# EAGLE design atari-2600-video-mod-v1.0 (EAGLE 7.6.0)
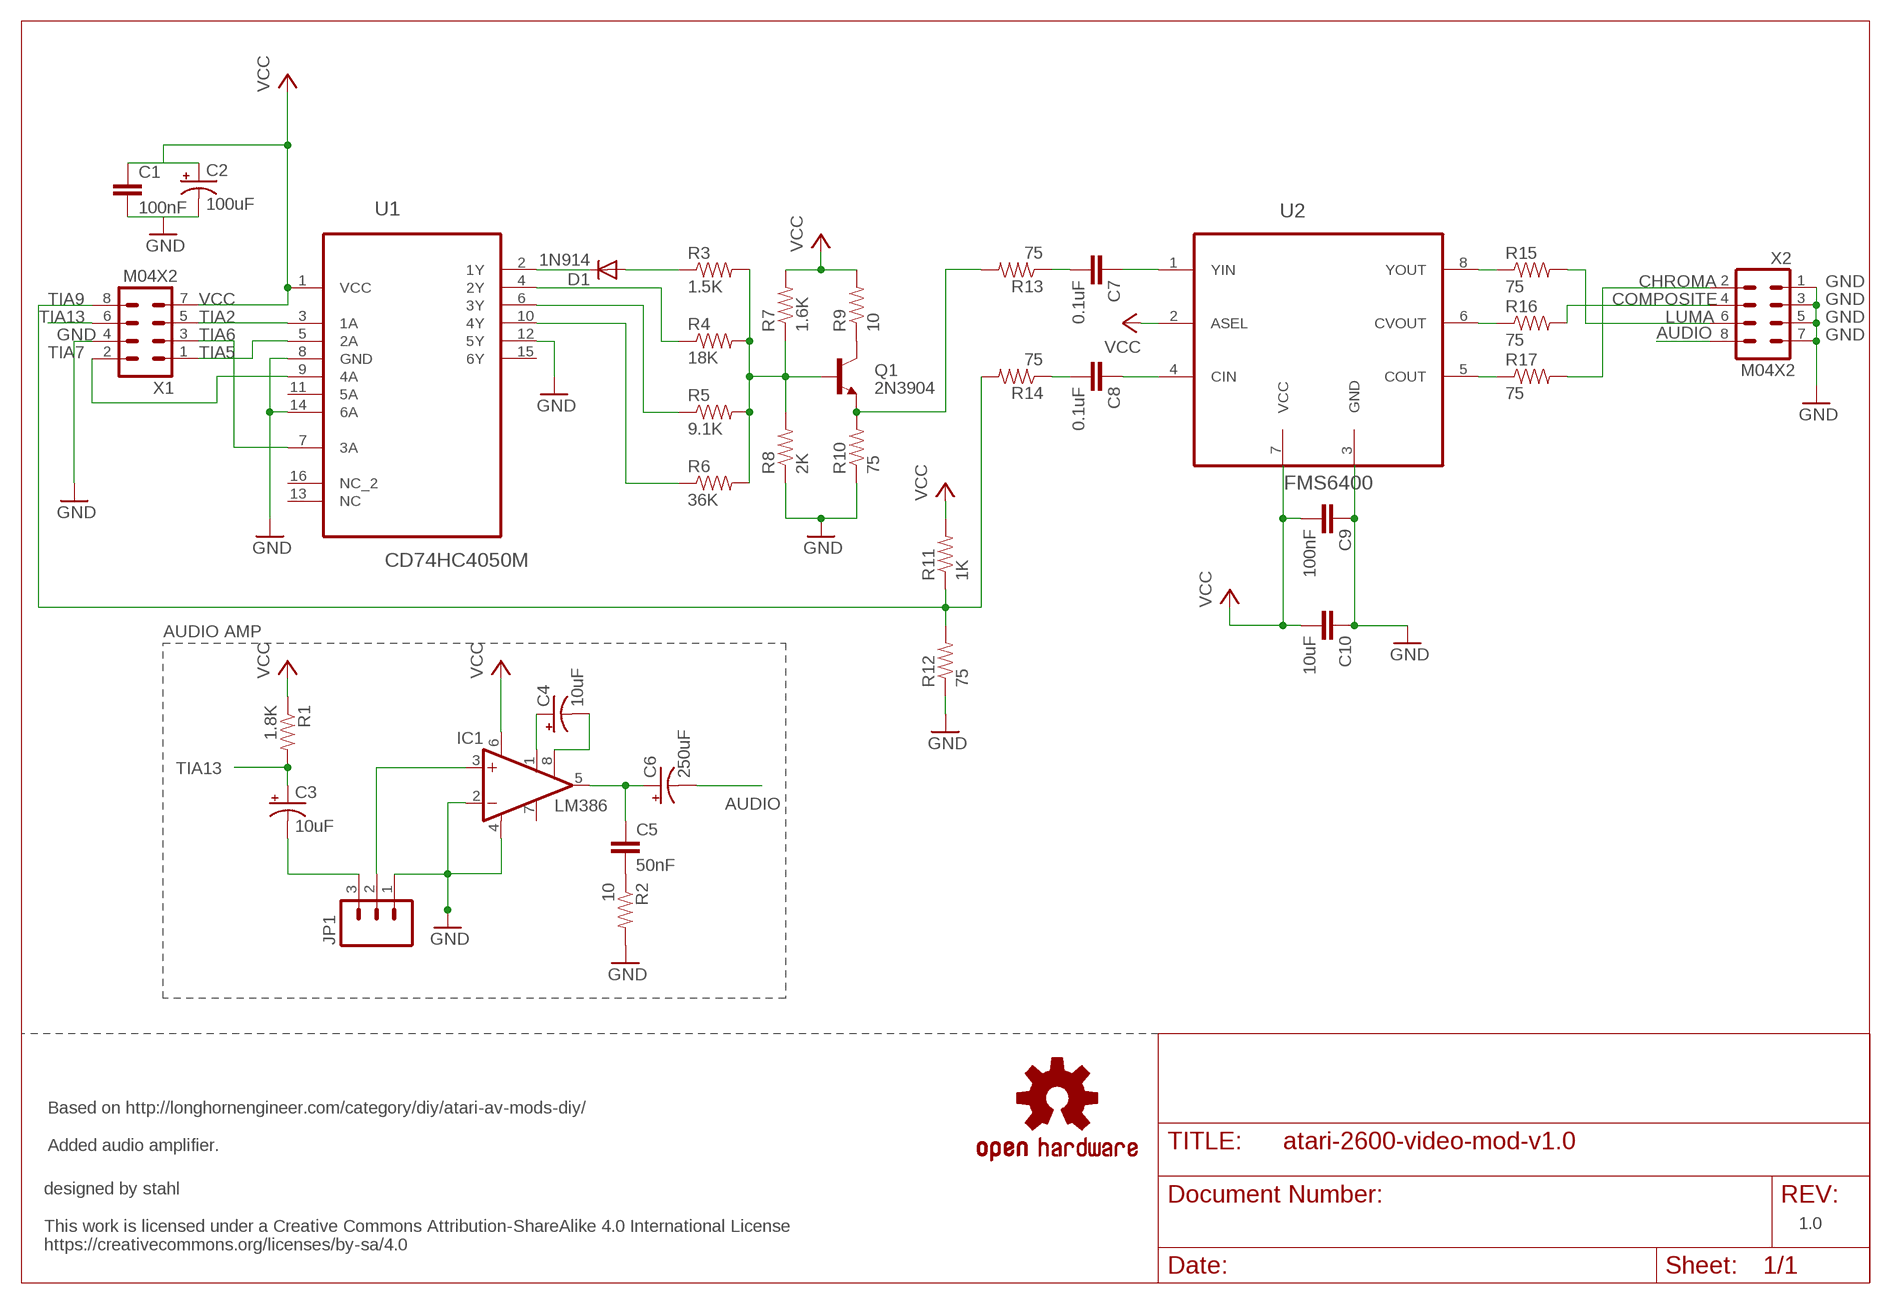
[diagram p0: schematic, sheet 1]

## Parts
C1  100nF  CAP1206  [1206]
C2  100uF  CPOL-USD  [PANASONIC_D]
C3  10uF  CPOL-USB  [PANASONIC_B]
C4  10uF  CPOL-USB  [PANASONIC_B]
C5  50nF  CAP1206  [1206]
C6  250uF  CPOL-USD  [PANASONIC_D]
C7  0.1uF  CAP1206  [1206]
C8  0.1uF  CAP1206  [1206]
C9  100nF  CAP1206  [1206]
C10  10uF  CAP1206  [1206]
D1  1N914  DIODE-SOD80C  [SOD80C]
IC1  LM386  LM386M-1  [SO08]
JP1  M03LONGPADS  [1X03_LONGPADS]
LOGO1  OSHW-LOGOS  [OSHW-LOGO-S]
Q1  2N3904  TRANSISTOR_NPNSOT23  [SOT23]
R1  1.8K  RESISTOR1206  [1206]
R2  10  RESISTOR1206  [1206]
R3  1.5K  RESISTOR1206  [1206]
R4  18K  RESISTOR1206  [1206]
R5  9.1K  RESISTOR1206  [1206]
R6  36K  RESISTOR1206  [1206]
R7  1.6K  RESISTOR1206  [1206]
R8  2K  RESISTOR1206  [1206]
R9  10  RESISTOR1206  [1206]
R10  75  RESISTOR1206  [1206]
R11  1K  RESISTOR1206  [1206]
R12  75  RESISTOR1206  [1206]
R13  75  RESISTOR1206  [1206]
R14  75  RESISTOR1206  [1206]
R15  75  RESISTOR1206  [1206]
R16  75  RESISTOR1206  [1206]
R17  75  RESISTOR1206  [1206]
U1  CD74HC4050M  [SOIC127P600X175-16N]
U2  FMS6400  [SOIC-8]
X1  M04X2  [2X4]
X2  M04X2  [2X4]

## Nets
AUDIO: C6.- X2.8
CHROMA: R17.2 X2.2
COMPOSITE: R16.2 X2.4
GND: C1.2 C2.- C9.1 C10.1 IC1.2(-IN) IC1.4(GND) JP1.1 R2.2 R8.1 R10.1 R12.1 U1.8(GND) U1.12(5Y) U1.14(6A) U2.3(GND) X1.4 X2.1 X2.3 X2.5 X2.7
LUMA: R15.2 X2.6
N$1: C8.1 U2.4(CIN)
N$2: R4.1 U1.4(2Y)
N$3: R5.1 U1.6(3Y)
N$4: R6.1 U1.10(4Y)
N$5: IC1.3(+IN) JP1.2
N$6: D1.C U1.2(1Y)
N$7: D1.A R3.1
N$8: Q1.3(C) R9.1
N$9: Q1.2(E) R10.2 R13.2
N$10: C7.1 U2.1(YIN)
N$11: C7.2 R13.1
N$12: C8.2 R14.1
N$13: R15.1 U2.8(YOUT)
N$14: R17.1 U2.5(COUT)
N$15: R16.1 U2.6(CVOUT)
N$16: C4.+ IC1.1(GAIN)
N$17: C4.- IC1.8(GAIN)
N$18: Q1.1(B) R3.2 R4.2 R5.2 R6.2 R7.1 R8.2
N$19: C5.2 R2.1
N$20: C5.1 C6.+ IC1.5(OUT)
N$21: C3.- JP1.3
TIA2: U1.3(1A) X1.5
TIA5: U1.5(2A) X1.1
TIA6: U1.7(3A) X1.3
TIA7: U1.9(4A) X1.2
TIA9: R11.1 R12.2 R14.2 X1.8
TIA13: C3.+ R1.2 X1.6
VCC: C1.1 C2.+ C9.2 C10.2 IC1.6(VS) R1.1 R7.2 R9.2 R11.2 U1.1(VCC) U2.2(ASEL) U2.7(VCC) X1.7
Unconnected: IC1.7(BYPASS) U1.11(5A) U1.13(NC) U1.15(6Y) U1.16(NC_2)

## Notes on the sheet
- AUDIO AMP
- Based on http://longhornengineer.com/category/diy/atari-av-mods-diy/
  
  Added audio amplifier.
- 1.0

## Library data of the parts
C1 C5 C7-C10 = SparkFun-Capacitors:CAP: Capacitor Standard 0603 ceramic capacitor, and 0.1" leaded capacitor.
C2-C4 C6 = rcl:CPOL-US: POLARIZED CAPACITOR, American symbol
D1 = diode:DIODE-: DIODE
IC1 = linear:LM386?-*: Low Voltage Audio Power Amplifier Source: http://cache.national.com/ds/LM/LM386.pdf
JP1 = SparkFun-Connectors:M03: Header 3 Standard 3-pin 0.1" header. Use with straight break away headers (SKU : PRT-00116), right angle break away headers (PRT-00553), swiss pins (PRT-00743), machine pins (PRT-00117), and female headers (PRT-00115). Molex polarized connector foot print use with SKU : PRT-08232 with associated crimp pins and housings.
LOGO1 = SparkFun-Aesthetics:OSHW-LOGO: Open Source Hardware Logo This logo indicates the piece of hardware it is found on incorporates a OSHW license and/or adheres to the definition of open source hardware found here: http://freedomdefined.org/OSHW
Q1 = SparkFun-DiscreteSemi:TRANSISTOR_NPN: Generic NPN BJT MMBT2222A - TRANS-08049 (SOT-23, 1A 40V) MPSA42 - TRANS-09116 (SOT-23, 500mA 300V) MMBT5088LT1G - TRANS-11160 (SOT-23, 50 mA 30V)
R1-R17 = SparkFun-Resistors:RESISTOR: Resistor Basic schematic elements and footprints for 0603, 1206, and PTH resistors.
U1 = Texas Instruments_By_element14_Batch_1:CD74HC4050M: High-Speed CMOS Logic Hex Buffers, Inverting and Non-Inverting; MPN: CD74HC4050M; OC_FARNELL: 1643824; OC_NEWARK: 66F5526; PACKAGE: SOIC-16; SUPPLIER: Texas Instruments
U2 = stahllabs:FMS6400: The FMS6400-1 is a dual Y/C 5 -order Butterworth low- pass video filter optimized for minimum overshoot and flat group delay. The device contains a summing circuit to generate filtered composite video. In a typical application, the Y and C input signals from DACs are AC coupled into the filters. Both channels have DC- restore circuitry to clamp the DC input levels during video sync. The Y and C channels use separate feedback clamps. The clamp pulse is derived from the Y channel. All outputs are capable of driving 2V PP , AC or DC coupled, into either a single or dual video load. A single video load consists of a series-75Ω impedance- matching resistor connected to a terminated 75Ω line. This presents a total of 150Ω of loading to the part. A dual load is two of these in parallel, which presents a total of 75Ω to the part. The gain of the Y, C, and CV signals can be selected for 0dB or 6dB with 1V PP input levels. All video channels are clamped during sync to establish the appropriate output voltage reference levels.; MPN: FMS6400; PACKAGE: SOIC-8
X1 X2 = SparkFun-Connectors:M04X2: .1" header, two rows of four.

## Board
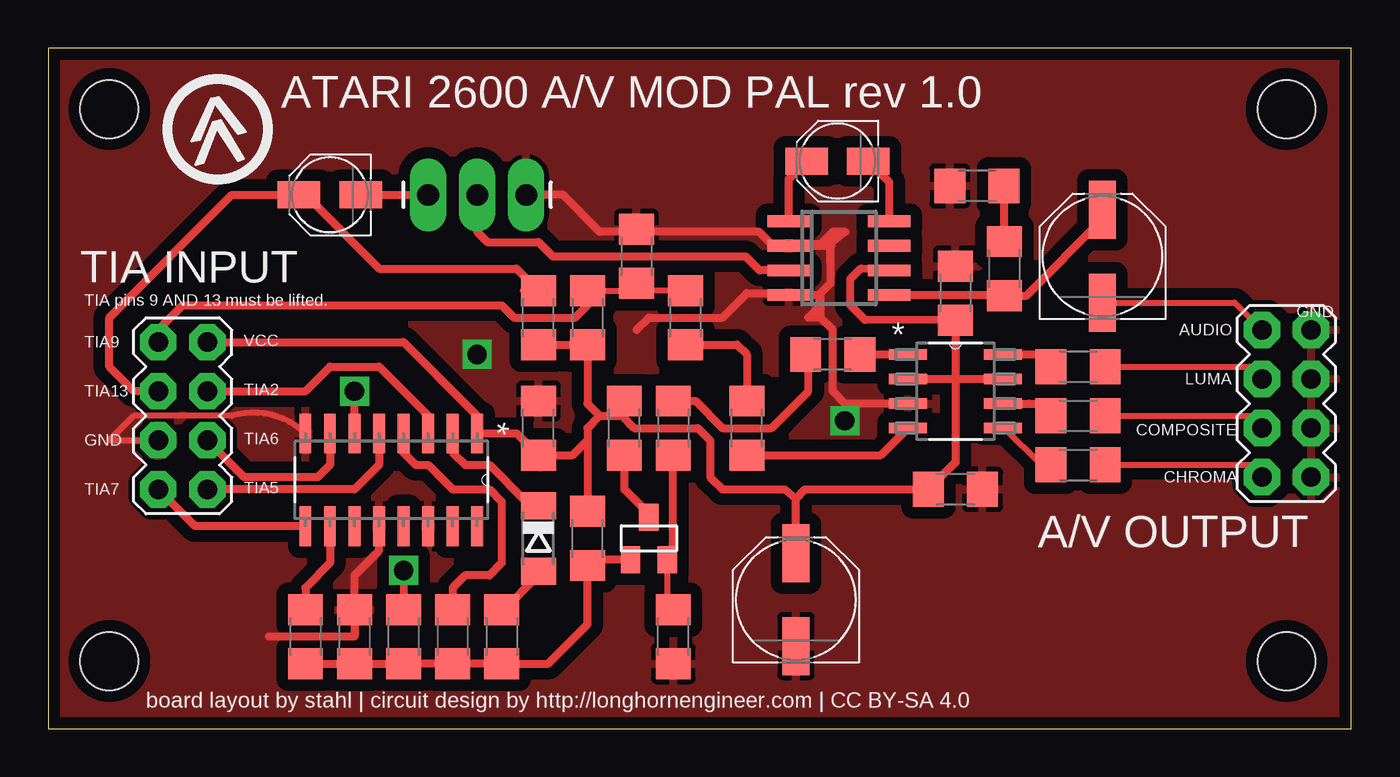
[diagram p1: board, top side]
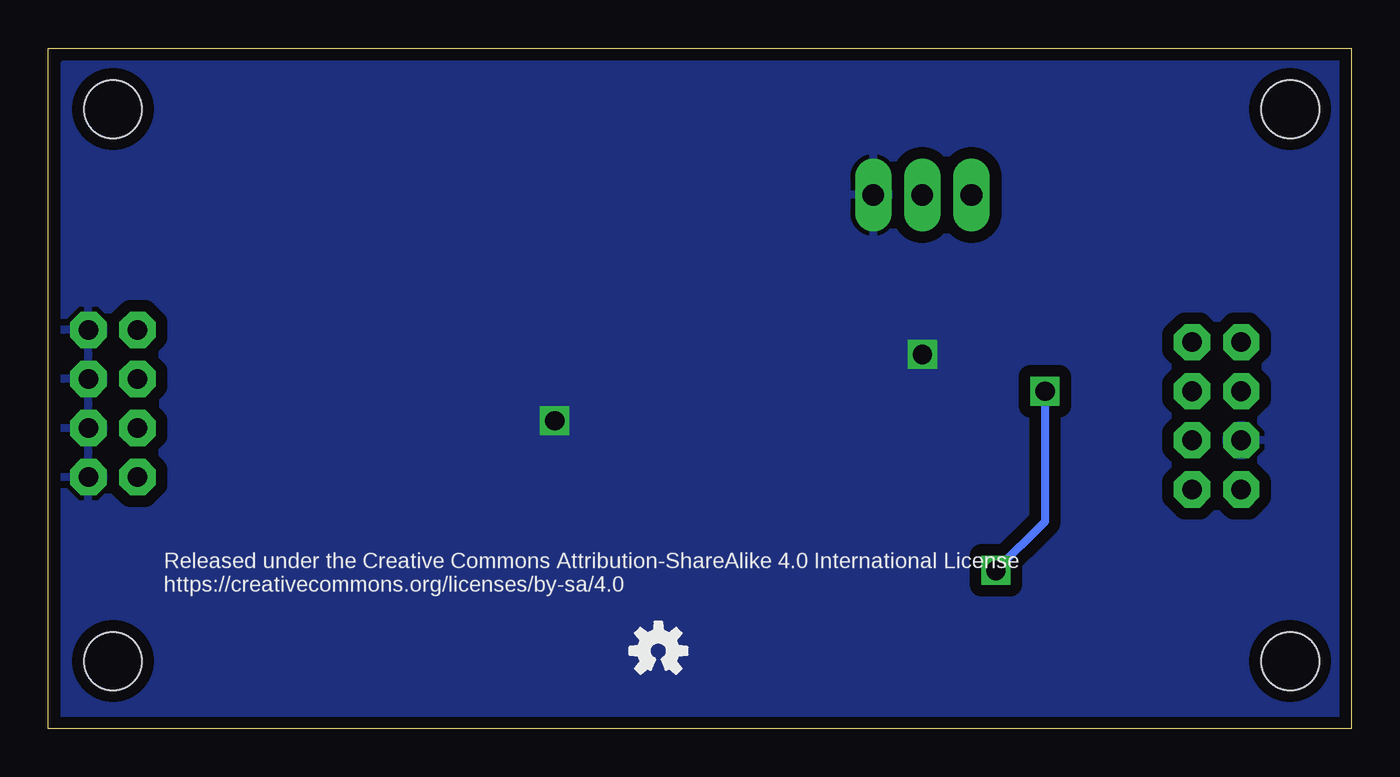
[diagram p2: board, bottom side, seen from below]

Size 67.47 x 35.21 mm. Coordinates in mm from the lower left corner, seen from the top.
Outline: 0,0 67.47,0 67.47,35.21 0,35.21 0,0
Copper layers (1*16): Top 0.035mm / dielectric 1.5mm / Bottom 0.035mm
Design rules "SeeedStudio_2layer_DRU_no_angle_20140221": minimum track width 6mil, minimum drill 12mil, track to track 6mil, track to pad 6mil, pad to pad 6mil, via to via 6mil, smd to smd 0mil, copper to edge 10mil, drill to drill 10mil, minimum pad ring 10mil, minimum via ring 6mil, stop-mask expansion 2mil, vias tented up to drill 100mil, thermal gap 10mil
Holes 3 mm at 3.16,3.49 3.16,32.07 64.12,32.07 64.12,3.49

### Footprints (pad centres in the part's own frame; a part is rotated, then mirrored left to right if it is on the bottom)
1206 = smd 1.6 x 1.8: 1 -1.4,0; 2 1.4,0
PANASONIC_D = smd 3 x 1.4: + 2.4,0; - -2.4,0
PANASONIC_B = smd 2.2 x 1.4: + 1.6,0; - -1.6,0
SOD80C = smd 1.4 x 1.8: A 1.7,0; C -1.7,0
SO08 = smd 0.6 x 2.2: 1 -1.905,-2.6; 2 -0.635,-2.6; 3 0.635,-2.6; 4 1.905,-2.6; 5 1.905,2.6; 6 0.635,2.6; 7 -0.635,2.6; 8 -1.905,2.6
1X03_LONGPADS = drill 1.118 pad 1.88 long: 1 0,0; 2 2.54,0; 3 5.08,0
SOT23 = smd 1 x 1.4: 1 -0.95,-1.1; 2 0.95,-1.1; 3 0,1.1
SOIC127P600X175-16N = smd 2.057 x 0.61: 1 -4.801,8.89; 2 -4.801,7.62; 3 -4.801,6.35; 4 -4.801,5.08; 5 -4.801,3.81; 6 -4.801,2.54; 7 -4.801,1.27; 8 -4.801,0; 9 0,0; 10 0,1.27; 11 0,2.54; 12 0,3.81; 13 0,5.08; 14 0,6.35; 15 0,7.62; 16 0,8.89
SOIC-8 = smd 1.981 x 0.559: 1 -2.464,1.905; 2 -2.464,0.635; 3 -2.464,-0.635; 4 -2.464,-1.905; 5 2.464,-1.905; 6 2.464,-0.635; 7 2.464,0.635; 8 2.464,1.905
2X4 = drill 1.016 pad 1.88 octagon: 1 -3.81,-1.27; 2 -3.81,1.27; 3 -1.27,-1.27; 4 -1.27,1.27; 5 1.27,-1.27; 6 1.27,1.27; 7 3.81,-1.27; 8 3.81,1.27

### Placement (x,y rotation side)
C1  25.38,15.56 90 top
C2  38.72,6.67 90 top
C3  14.59,27.62 180 top
C4  40.87,29.37 180 top
C5  49.51,23.81 90 top
C6  54.59,24.45 90 top
C7  40.62,19.37 180 top
C8  36.18,15.56 90 top
C9  46.97,22.54 270 top
C10  46.97,12.38 180 top
D1  25.38,9.84 270 top
IC1  40.95,24.36 270 top
JP1  24.75,27.62 180 top
LOGO1  35.88,4.02 0 bottom
Q1  31.1,9.84 0 top
R1  25.38,21.27 90 top
R2  48.08,28.09 180 top
R3  23.48,4.76 270 top
R4  20.94,4.76 270 top
R5  18.4,4.76 270 top
R6  13.32,4.76 270 top
R7  27.92,9.84 90 top
R8  15.86,4.76 270 top
R9  29.83,15.56 90 top
R10  32.37,4.76 90 top
R11  27.92,21.27 270 top
R12  30.46,24.45 270 top
R13  32.37,15.56 270 top
R14  33,21.27 90 top
R15  53.32,18.73 0 top
R16  53.32,16.19 0 top
R17  53.32,13.65 0 top
U1  13.32,10.48 270 top
U2  46.97,17.46 0 top
U$1  [ATARI-AGE]  6.23,28.49 0 top
X1  6.97,16.19 90 top
X2  64.12,16.83 90 top

### Tracks (layer width: path | path; a pad name or v marks a point on that pad's centre or on a via)
AUDIO
  Top 0.305: C6.- 61.44,22.05 X2.8
CHROMA
  Top 0.305: R17.2 62.21,13.65 X2.2
COMPOSITE
  Top 0.305: R16.2 62.21,16.19 X2.4
GND  (via drill 1)
  Top 0.305: U1.8 arc60 9.51,16.19 4.43,16.19 3.16,14.92 X1.4
  Top 0.406: 11.41,4.76 15.86,4.76 R8.1 15.86,7.94 17.13,9.21 U1.12 | 39.9,22.45 IC1.4 38.26,22.54 36.18,22.54 34.91,21.27 31.1,21.27 30.46,20.64 | 39.9,22.45 39.99,22.54 | 40.5,25.1 40.53,24.99 IC1.2 37.45,25.08 | 39.99,21.27 39.99,21.73 | 39.99,21.73 39.9,22.45 | U2.3 41.26,16.83 40.62,17.46 40.62,20.64 39.99,21.27 | 39.99,21.27 39.35,21.27 39.99,21.91 | 39.99,21.73 39.99,22.54 | 39.99,22.54 40.52,23.07 40.5,25.1 | 40.5,25.1 41.26,25.72 40.62,25.72 39.99,25.08 37.45,25.08 | 37.45,25.08 36.81,25.72 28.56,25.72 26.65,27.62 JP1.1
  other vias: 22.21,19.37 41.25,15.94
  pour Top (isolate 0.61): 0.62,34.61 66.79,34.61 66.79,0.54 0.62,0.54
  pour Bottom (isolate 0.61): 66.66,0.32 0.48,0.32 0.48,34.38 66.66,34.38
LUMA
  Top 0.305: R15.2 62.21,18.73 X2.6
N$1
  Top 0.406: C8.1 43.11,14.16 U2.4
N$2
  Top 0.406: U1.4 18.4,14.29 19.03,13.65 19.67,13.65 20.94,12.38 22.84,12.38 23.48,11.75 23.48,8.57 22.84,7.94 21.57,7.94 20.94,7.3 R4.1
N$3  (via drill 1)
  Top 0.406: U1.6 v15.86,17.46 | v18.4,8.18 R5.1
  Bottom 0.406: v15.86,17.46 15.86,10.71 v18.4,8.18
N$4
  Top 0.406: U1.10 14.59,8.57 13.32,7.3 R6.1
N$5
  Top 0.406: JP1.2 22.21,25.72 22.74,25.18 25.38,25.18 26.12,24.45 36.11,24.45 36.84,23.72 IC1.3
N$6
  Top 0.406: U1.2 20.94,14.29 21.57,13.65 22.84,13.65 24.75,11.75 25.18,11.75 D1.C
N$7
  Top 0.406: D1.A 25.45,8 23.48,6.03 23.61,6.03 R3.1
N$8
  Top 0.406: Q1.3 31.1,11.11 29.83,12.38 R9.1
N$9
  Top 0.305: Q1.2 32.05,6.48 R10.2
  Top 0.406: Q1.2 32.35,8.44 32.35,11.73 32.34,13.12 R13.2
N$10
  Top 0.406: C7.1 U2.1
N$11
  Top 0.406: 39.35,18.73 C7.2 39.35,19.24 39.35,17.46 37.45,15.56 34.91,15.56 33.51,16.96 R13.1
N$12
  Top 0.406: R14.1 35.67,19.87 36.18,19.37 C8.2
N$13
  Top 0.406: U2.8 51.92,19.37 R15.1
N$14
  Top 0.305: U2.5 49.51,15.56 51.42,13.65
  Top 0.406: 51.42,13.65 R17.1
N$15
  Top 0.406: 50.78,16.83 U2.6 51.92,16.83 R16.1
N$16
  Top 0.406: IC1.1 38.35,28.46 C4.+
N$17
  Top 0.406: IC1.8 43.55,28.29 C4.-
N$18
  Top 0.406: R5.2 R4.2 R3.2 25.89,3.36 27.92,5.4 R7.1 28.22,8.74 Q1.1 | R5.2 18.4,3.49 | R8.2 R5.2 | R6.2 R5.2
N$19
  Top 0.406: C5.2 49.51,27.49 R2.1
N$20
  Top 0.406: 54.23,25.98 54.32,26.2 | 54.32,26.2 C6.+ | IC1.5 49.51,22.45 C5.1 50.65,22.41 54.59,26.35 54.53,26.35 | 54.53,26.35 54.32,26.35 54.32,26.2 | 54.53,26.35 54.53,27.06 54.57,27.06 54.57,26.84 | 54.57,26.46 54.57,26.84 | 54.57,26.84 54.66,26.84 54.66,26.63 54.87,26.63 54.87,25.85 54.68,25.85 54.68,25.91 arc-45 54.66,26.45 54.5,26.45 54.5,26.09
N$21
  Top 0.406: C3.- JP1.3
TIA2
  Top 0.406: X1.5 13.32,17.46 14.59,18.73 17.13,18.73 19.67,16.19 U1.3
TIA5
  Top 0.406: U1.5 17.13,13.65 15.86,12.38 X1.1
TIA6
  Top 0.406: U1.7 14.59,13.65 13.95,13.02 10.14,13.02 X1.3
TIA7
  Top 0.406: U1.9 7.6,10.48 X1.2
TIA9
  Top 0.305: R11.1 30.09,22.67 R12.2 30.84,22.67 R14.2
  Top 0.406: X1.8 5.7,20.64 6.97,21.91 23.48,21.91 24.11,21.27 27.29,21.27 27.92,21.91 R11.1
TIA13
  Top 0.406: 24.62,22.67 R1.2 24.24,23.81 17.13,23.81 13.32,27.62 C3.+ 9.51,27.62 3.16,21.27 3.16,18.73 4.43,17.46 X1.6
VCC
  Top 0.406: 27.92,14.92 27.92,15.56 28.56,16.19 | 27.92,14.92 R7.2 | R1.1 R11.2 27.92,16.83 28.56,16.19 | 28.56,16.19 29.7,16.19 | C1.1 25.51,13.52 | C2.+ 38.7,11.9 | 38.7,11.9 38.14,12.38 34.91,12.38 34.27,13.02 34.27,14.92 33.64,15.56 30.33,15.56 29.7,16.19 | 38.7,11.9 39.17,12.38 C10.2 46.97,13.78 46.97,18.1 | 46.97,18.1 U2.7 | U2.2 46.97,18.1 | 46.97,18.1 C9.2 42.29,21.15 41.54,21.91 41.53,23.27 42.09,23.83 43.46,23.81 IC1.6 | X1.7 18.4,20 22.21,16.19 U1.1 24.26,15.28 C1.1 | C1.1 27.16,14.16 27.92,14.92 | 29.7,16.19 29.7,16.83 R9.2

### Text on the board
tNames: ATARI 2600 A/V MOD PAL rev 1.0 | TIA INPUT | TIA pins 9 AND 13 must be lifted. | GND | AUDIO | TIA9 | VCC | TIA13 | TIA2 | LUMA | COMPOSITE | GND | TIA6 | TIA7 | TIA5 | CHROMA | A/V OUTPUT | board layout by stahl | circuit design by http://longhornengineer.com | CC BY-SA 4.0
bNames: Released under the Creative Commons Attribution-ShareAlike 4.0 International License / https://creativecommons.org/licenses/by-sa/4.0